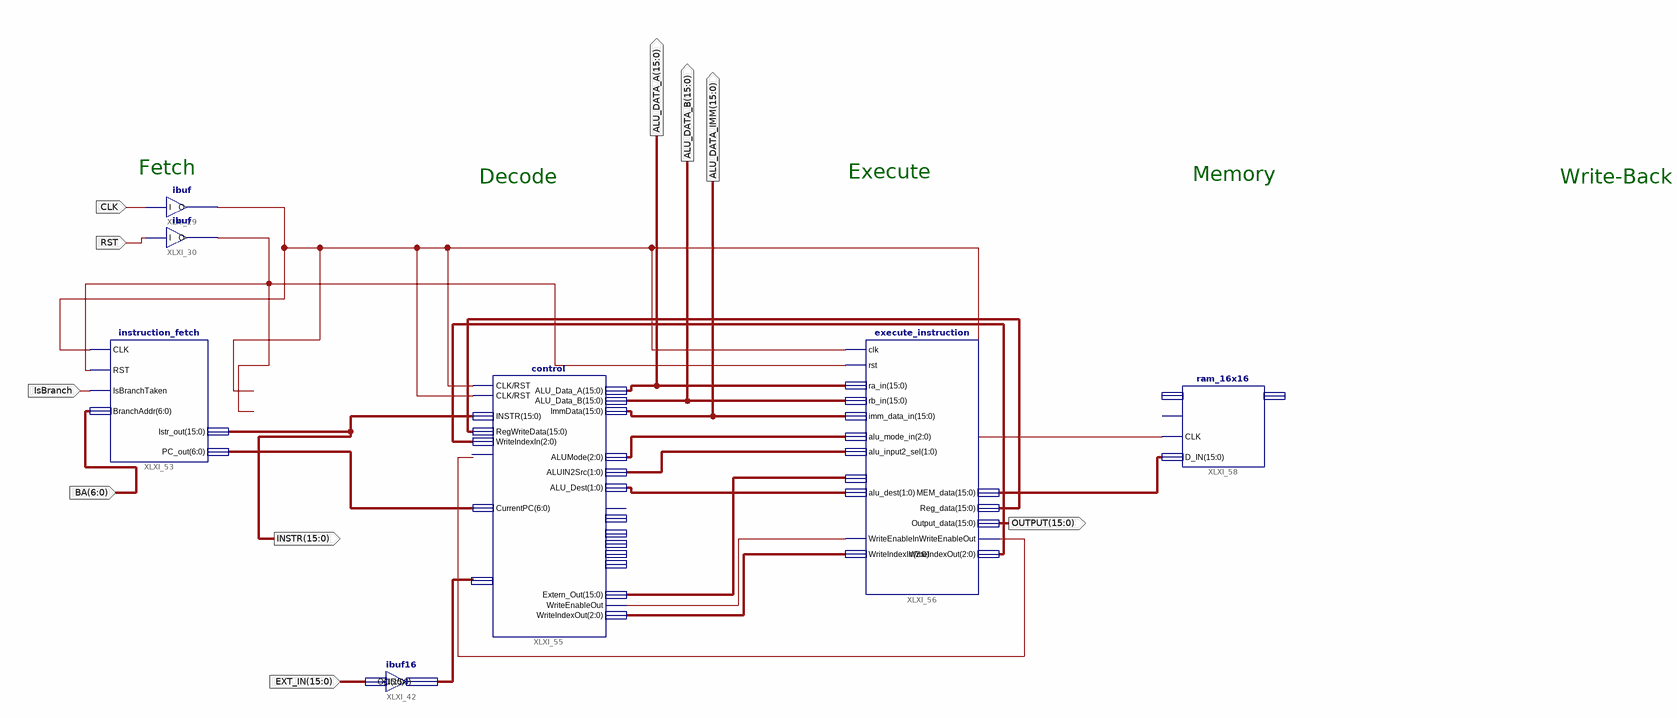
[diagram p0: schematic sheet 1]
// Xilinx ISE schematic cpu.sch (spartan3e) as structural Verilog: 7 symbols, 10 ports
module cpu (
  input  CLK,
  input  RST,
  input  [6:0] BA,
  input  IsBranch,
  input  [15:0] EXT_IN,
  output [15:0] ALU_DATA_A,
  output [15:0] ALU_DATA_B,
  output [15:0] ALU_DATA_IMM,
  output [15:0] OUTPUT,
  output [15:0] INSTR
);

  wire BT, XLXN_514, XLXN_570, XLXN_573;
  wire [1:0] XLXN_520, XLXN_522;
  wire [2:0] XLXN_519, XLXN_571, XLXN_572;
  wire [6:0] XLXN_521;
  wire [15:0] XLXN_524, XLXN_561, XLXN_562, XLXN_569;

  control XLXI_55 (
    .CLK(BT), .RST(BT), .WriteEnableIn(XLXN_573), .INSTR(INSTR), .RegWriteData(XLXN_569),
    .WriteIndexIn(XLXN_572), .CurrentPC(XLXN_521), .Extern_In(XLXN_561), .WriteEnableOut(XLXN_570),
    .WriteIndexOut(XLXN_571), .ALUMode(XLXN_519), .ALUIN2Src(XLXN_520), .ALU_Dest(XLXN_522),
    .ALU_Data_A(ALU_DATA_A), .ALU_Data_B(ALU_DATA_B), .ImmData(ALU_DATA_IMM), .Extern_Out(XLXN_562));  // open: BranchTaken, BranchPC, MemMode, MemDestAddr, MemSrcAddr, MemData
  execute_instruction XLXI_56 (
    .clk(BT), .rst(XLXN_514), .WriteEnableIn(XLXN_570), .ra_in(ALU_DATA_A), .rb_in(ALU_DATA_B),
    .imm_data_in(ALU_DATA_IMM), .extern_data_in(XLXN_562), .alu_mode_in(XLXN_519), .alu_input2_sel(XLXN_520),
    .alu_dest(XLXN_522), .WriteIndexIn(XLXN_571), .WriteEnableOut(XLXN_573), .MEM_data(XLXN_524),
    .Reg_data(XLXN_569), .Output_data(OUTPUT), .WriteIndexOut(XLXN_572));
  ibuf XLXI_29 (.I(CLK), .O(BT));
  ibuf XLXI_30 (.I(RST), .O(XLXN_514));
  instruction_fetch XLXI_53 (
    .CLK(BT), .RST(XLXN_514), .IsBranchTaken(IsBranch), .BranchAddr(BA), .Istr_out(INSTR), .PC_out(XLXN_521));
  ram_16x16 XLXI_58 (.CLK(BT), .D_IN(XLXN_524));  // open: ADDR, WE, D_OUT
  ibuf16 XLXI_42 (.I(EXT_IN), .O(XLXN_561));

  // Notes on the sheet:
  //   Fetch
  //   Execute
  //   Memory
  //   Decode
  //   Write-Back
endmodule
